# EAGLE design Shield (EAGLE 9.4.2)
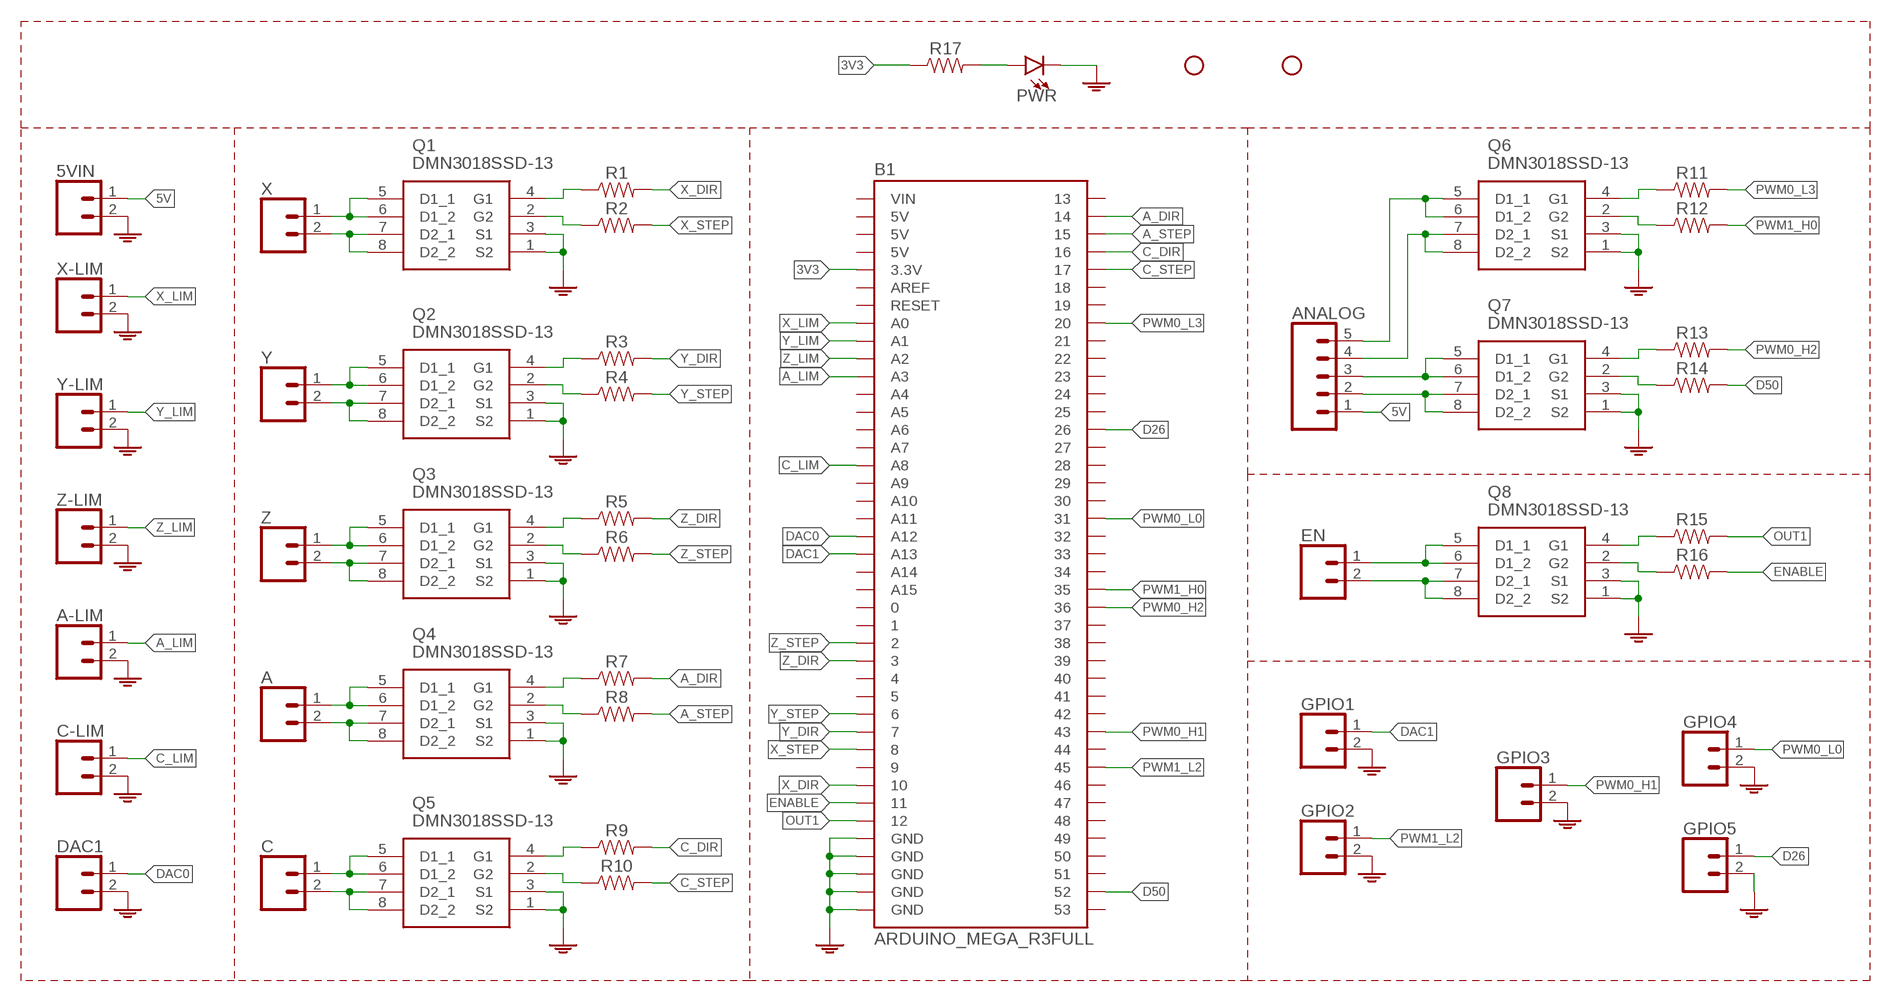
[diagram p0: schematic, sheet 1]

## Parts
5VIN  2P-SCREWTERMINAL-PLUGABLE  [SCREWTERMINAL-3.5MM-2_LOCK]
A  2P-SCREWTERMINAL-PLUGABLE  [SCREWTERMINAL-3.5MM-2_LOCK]
A-LIM  2P-SCREWTERMINAL-PLUGABLE  [SCREWTERMINAL-3.5MM-2_LOCK]
ANALOG  JST-XH-5P  [JST-XH-5P]
B1  ARDUINO_MEGA_R3FULL  [ARDUINO_MEGA]
C  2P-SCREWTERMINAL-PLUGABLE  [SCREWTERMINAL-3.5MM-2_LOCK]
C-LIM  2P-SCREWTERMINAL-PLUGABLE  [SCREWTERMINAL-3.5MM-2_LOCK]
DAC1  2P-SCREWTERMINAL-PLUGABLE  [SCREWTERMINAL-3.5MM-2_LOCK]
EN  2P-SCREWTERMINAL-PLUGABLE  [SCREWTERMINAL-3.5MM-2_LOCK]
GPIO1  2P-SCREWTERMINAL-PLUGABLE  [SCREWTERMINAL-3.5MM-2_LOCK]
GPIO2  2P-SCREWTERMINAL-PLUGABLE  [SCREWTERMINAL-3.5MM-2_LOCK]
GPIO3  2P-SCREWTERMINAL-PLUGABLE  [SCREWTERMINAL-3.5MM-2_LOCK]
GPIO4  2P-SCREWTERMINAL-PLUGABLE  [SCREWTERMINAL-3.5MM-2_LOCK]
GPIO5  2P-SCREWTERMINAL-PLUGABLE  [SCREWTERMINAL-3.5MM-2_LOCK]
H1  STAND-OFF  [STAND-OFF]
H2  STAND-OFF  [STAND-OFF]
PWR  LED-1206  [LED_1206]
Q1  DMN3018SSD-13  [SOIC127P600X175-8N]
Q2  DMN3018SSD-13  [SOIC127P600X175-8N]
Q3  DMN3018SSD-13  [SOIC127P600X175-8N]
Q4  DMN3018SSD-13  [SOIC127P600X175-8N]
Q5  DMN3018SSD-13  [SOIC127P600X175-8N]
Q6  DMN3018SSD-13  [SOIC127P600X175-8N]
Q7  DMN3018SSD-13  [SOIC127P600X175-8N]
Q8  DMN3018SSD-13  [SOIC127P600X175-8N]
R1  RESISTOR-SMD-1206  [RES_1206]
R2  RESISTOR-SMD-1206  [RES_1206]
R3  RESISTOR-SMD-1206  [RES_1206]
R4  RESISTOR-SMD-1206  [RES_1206]
R5  RESISTOR-SMD-1206  [RES_1206]
R6  RESISTOR-SMD-1206  [RES_1206]
R7  RESISTOR-SMD-1206  [RES_1206]
R8  RESISTOR-SMD-1206  [RES_1206]
R9  RESISTOR-SMD-1206  [RES_1206]
R10  RESISTOR-SMD-1206  [RES_1206]
R11  RESISTOR-SMD-1206  [RES_1206]
R12  RESISTOR-SMD-1206  [RES_1206]
R13  RESISTOR-SMD-1206  [RES_1206]
R14  RESISTOR-SMD-1206  [RES_1206]
R15  RESISTOR-SMD-1206  [RES_1206]
R16  RESISTOR-SMD-1206  [RES_1206]
R17  RESISTOR-SMD-1206  [RES_1206]
X  2P-SCREWTERMINAL-PLUGABLE  [SCREWTERMINAL-3.5MM-2_LOCK]
X-LIM  2P-SCREWTERMINAL-PLUGABLE  [SCREWTERMINAL-3.5MM-2_LOCK]
Y  2P-SCREWTERMINAL-PLUGABLE  [SCREWTERMINAL-3.5MM-2_LOCK]
Y-LIM  2P-SCREWTERMINAL-PLUGABLE  [SCREWTERMINAL-3.5MM-2_LOCK]
Z  2P-SCREWTERMINAL-PLUGABLE  [SCREWTERMINAL-3.5MM-2_LOCK]
Z-LIM  2P-SCREWTERMINAL-PLUGABLE  [SCREWTERMINAL-3.5MM-2_LOCK]

## Nets
3V3: B1.3.3V R17.1
5V: 5VIN.1 ANALOG.1
A_DIR: B1.14 R7.2
A_LIM: A-LIM.1 B1.A3
A_STEP: B1.15 R8.2
AGND: 5VIN.2 A-LIM.2 B1.GND@0(GND) B1.GND@1(GND) B1.GND@2(GND) B1.GND@3(GND) B1.GND@4(GND) C-LIM.2 DAC1.2 GPIO1.2 GPIO2.2 GPIO3.2 GPIO4.2 GPIO5.2 PWR.C Q1.1(S2) Q1.3(S1) Q2.1(S2) Q2.3(S1) Q3.1(S2) Q3.3(S1) Q4.1(S2) Q4.3(S1) Q5.1(S2) Q5.3(S1) Q6.1(S2) Q6.3(S1) Q7.1(S2) Q7.3(S1) Q8.1(S2) Q8.3(S1) X-LIM.2 Y-LIM.2 Z-LIM.2 ; supply symbol labelled GND
C_DIR: B1.16 R9.2
C_LIM: B1.A8 C-LIM.1
C_STEP: B1.17 R10.2
D26: B1.26 GPIO5.1
D50: B1.52 R14.2
DAC0: B1.A12 DAC1.1
DAC1: B1.A13 GPIO1.1
ENABLE: B1.11 R16.2
N$1: Q1.7(D2_1) Q1.8(D2_2) X.2
N$2: Q1.5(D1_1) Q1.6(D1_2) X.1
N$3: Q2.7(D2_1) Q2.8(D2_2) Y.2
N$4: EN.2 Q8.7(D2_1) Q8.8(D2_2)
N$5: Q1.2(G2) R2.1
N$6: Q1.4(G1) R1.1
N$7: EN.1 Q8.5(D1_1) Q8.6(D1_2)
N$8: Q2.5(D1_1) Q2.6(D1_2) Y.1
N$9: Q2.2(G2) R4.1
N$10: Q8.2(G2) R16.1
N$11: Q8.4(G1) R15.1
N$12: Q2.4(G1) R3.1
N$13: Q3.7(D2_1) Q3.8(D2_2) Z.2
N$14: Q3.5(D1_1) Q3.6(D1_2) Z.1
N$15: PWR.A R17.2
N$16: Q3.2(G2) R6.1
N$25: Q3.4(G1) R5.1
N$26: A.2 Q4.7(D2_1) Q4.8(D2_2)
N$27: A.1 Q4.5(D1_1) Q4.6(D1_2)
N$28: Q4.2(G2) R8.1
N$37: Q4.4(G1) R7.1
N$38: C.2 Q5.7(D2_1) Q5.8(D2_2)
N$39: C.1 Q5.5(D1_1) Q5.6(D1_2)
N$40: Q5.2(G2) R10.1
N$41: Q5.4(G1) R9.1
N$42: ANALOG.4 Q6.7(D2_1) Q6.8(D2_2)
N$43: ANALOG.5 Q6.5(D1_1) Q6.6(D1_2)
N$44: Q6.2(G2) R12.1
N$45: Q6.4(G1) R11.1
N$46: ANALOG.2 Q7.7(D2_1) Q7.8(D2_2)
N$47: ANALOG.3 Q7.5(D1_1) Q7.6(D1_2)
N$48: Q7.2(G2) R14.1
N$49: Q7.4(G1) R13.1
OUT1: B1.12 R15.2
PWM0_H1: B1.43 GPIO3.1
PWM0_H2: B1.36 R13.2
PWM0_L0: B1.31 GPIO4.1
PWM0_L3: B1.20 R11.2
PWM1_H0: B1.35 R12.2
PWM1_L2: B1.45 GPIO2.1
X_DIR: B1.10 R1.2
X_LIM: B1.A0 X-LIM.1
X_STEP: B1.8 R2.2
Y_DIR: B1.7 R3.2
Y_LIM: B1.A1 Y-LIM.1
Y_STEP: B1.6 R4.2
Z_DIR: B1.3 R5.2
Z_LIM: B1.A2 Z-LIM.1
Z_STEP: B1.2 R6.2
Unconnected: B1.0 B1.1 B1.4 B1.5 B1.5V@0(5V) B1.5V@1(5V) B1.5V@2(5V) B1.9 B1.13 B1.18 B1.19 B1.21 B1.22 B1.23 B1.24 B1.25 B1.27 B1.28 B1.29 B1.30 B1.32 B1.33 B1.34 B1.37 B1.38 B1.39 B1.40 B1.41 B1.42 B1.44 B1.46 B1.47 B1.48 B1.49 B1.50 B1.51 B1.53 B1.A4 B1.A5 B1.A6 B1.A7 B1.A9 B1.A10 B1.A11 B1.A14 B1.A15 B1.AREF B1.RESET B1.VIN

## Library data of the parts
5VIN A A-LIM C C-LIM DAC1 EN GPIO1-GPIO5 X X-LIM Y Y-LIM Z Z-LIM = Shield:2P-SCREWTERMINAL-PLUGABLE: 2P Screw Terminal ; 3.5mm pitch; Plugable Dont forget the cleareance nedded for the plug
ANALOG = Shield:JST-XH-5P
B1 = Shield:ARDUINO_MEGA_R3: Arduino Mega R3 ATmega2560 R3 compatible footprint. SparkFun Products: Arduino Mega 2560 R3 <https://www.sparkfun.com/products/11061>
H1 H2 = SparkFun-Hardware:STAND-OFF: Stand Off Drill holes for mechanically mounting via screws, standoffs, etc. Note: Use the keepout ring to avoid running the screw head into surrounding components. Variant Overviews STAND-OFF - Mechanical footprint for a #4 phillips button head screw. STAND-OFF-TIGHT - Mechanical footprint for a #4 phillips button head screw, Example SparkFun Products Screw - Phillips Head (1/4", 4-40, 10 pack) <https://www.sparkfun.com/products/10453> (PRT-10453) Screw - Phillips Head (1/2", 4-40, 10 pack) <https://www.sparkfun.com/products/10452> (PRT-10452) Screw - Phillips Head (3/4", 4-40, 10 pack) <https://www.sparkfun.com/products/10451> (PRT-10451) Screw - Phillips Head (1", 4-40, 10 pack) <https://www.sparkfun.com/products/10450> (PRT-10450)
PWR = Shield:LED-1206
Q1-Q8 = Shield:DMN3018SSD-13: Diodes Inc DMN3018SSD-13 N-channel MOSFET Transistor, 8.7 A, 30 V, 8-Pin SOIC Source: Datasheet <https://componentsearchengine.com/Datasheets/1/DMN3018SSD-13.pdf>; DESCRIPTION: Diodes Inc DMN3018SSD-13 N-channel MOSFET Transistor, 8.7 A, 30 V, 8-Pin SOIC; HEIGHT: 1.75mm; MANUFACTURER_NAME: Diodes Inc.; MANUFACTURER_PART_NUMBER: DMN3018SSD-13; MOUSER_PART_NUMBER: 621-DMN3018SSD-13; MOUSER_PRICE-STOCK: https://www.mouser.com/Search/Refine.aspx?Keyword=621-DMN3018SSD-13
R1-R17 = Shield:RESISTOR-SMD-1206

## Board
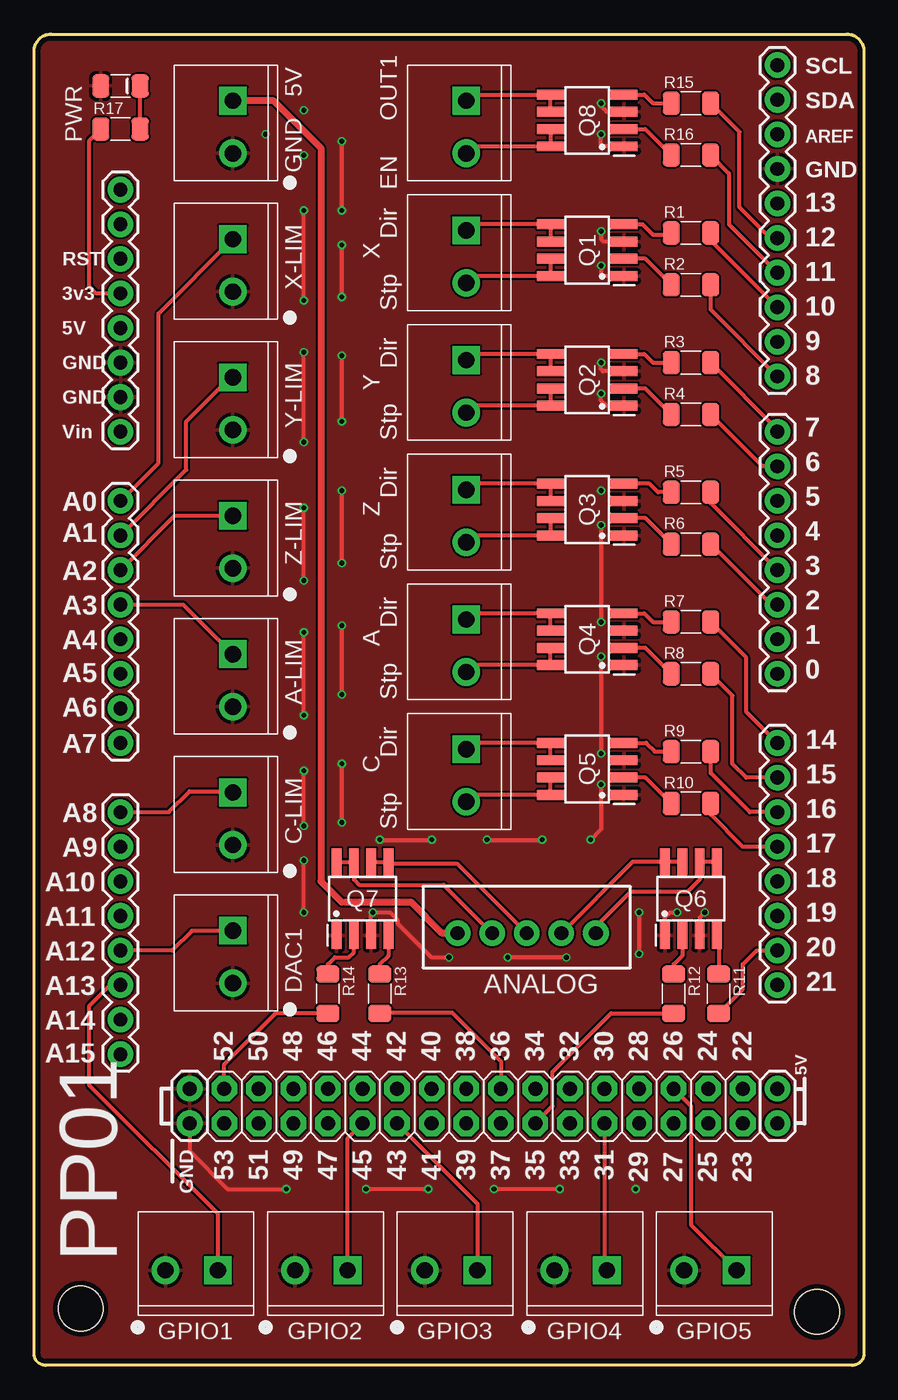
[diagram p1: board, top side]
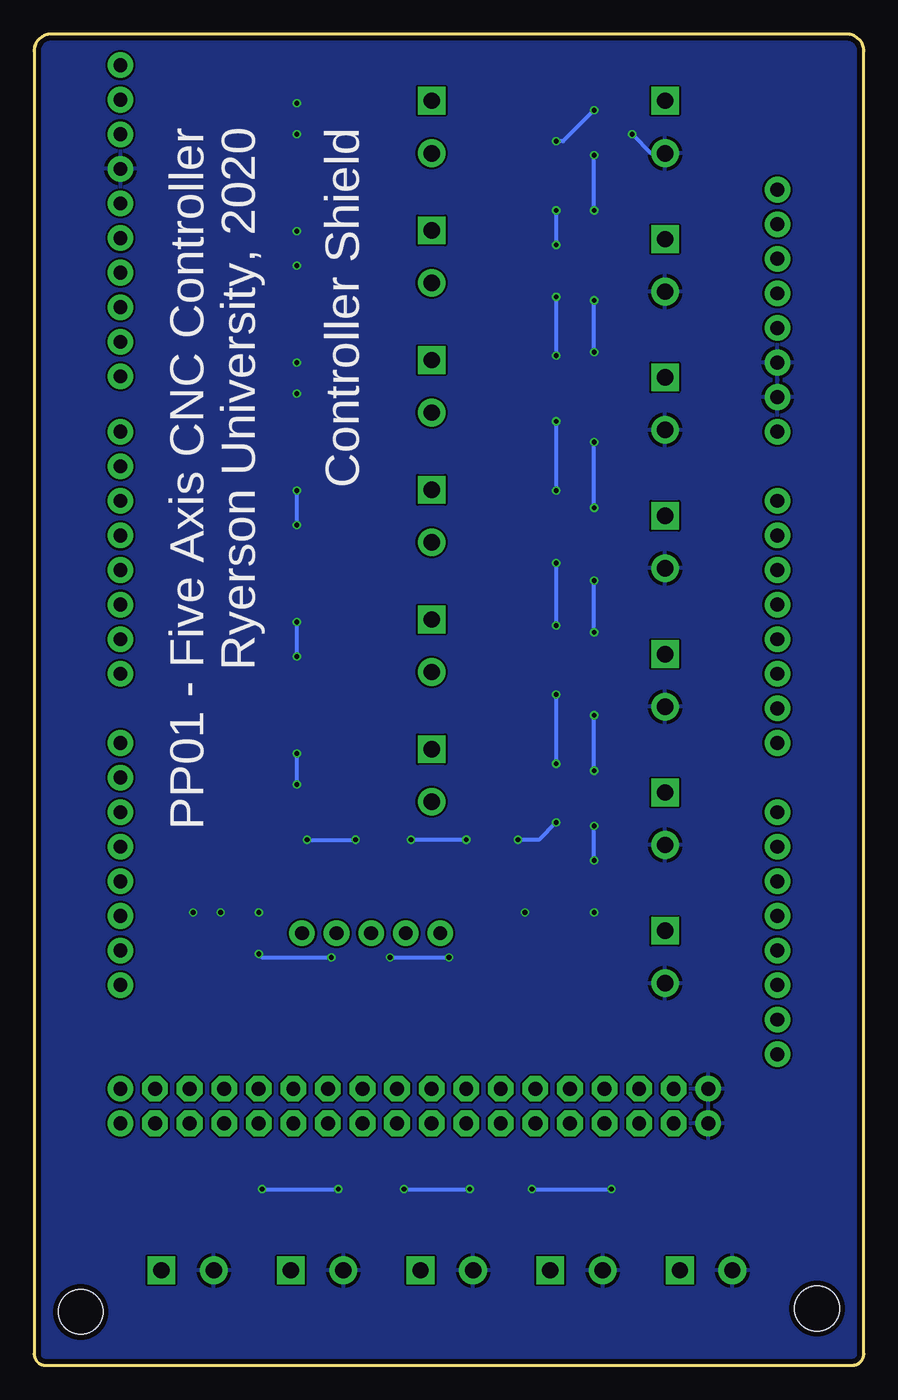
[diagram p2: board, bottom side, seen from below]

Size 60.96 x 97.79 mm. Coordinates in mm from the lower left corner, seen from the top.
Outline: 1.27,97.79 59.69,97.79 arc-90 60.96,96.52 60.96,0.87 arc-90 60.09,0 0.87,0 arc-90 0,0.87 0,96.52 arc-90 1.27,97.79
Copper layers (1*16): Top 0.035559375mm / dielectric 1.6mm / Bottom 0.035559375mm
Design rules "oshpark-2layer-tented *": minimum track width 12mil, minimum drill 10mil, track to track 6mil, track to pad 6mil, pad to pad 6mil, via to via 6mil, smd to smd 6mil, copper to edge 15mil, drill to drill 6mil, minimum pad ring 5mil, minimum via ring 5mil, stop-mask expansion 2.5mil, vias tented up to drill 20mil, thermal gap 10mil

### Footprints (pad centres in the part's own frame; a part is rotated, then mirrored left to right if it is on the bottom)
SCREWTERMINAL-3.5MM-2_LOCK = drill 1.2 pad 2.032 square: 1 -0.178,0 | drill 1.2 pad 2.032: 2 3.678,0
JST-XH-5P = drill 1.016 pad 1.88: 1 0,0; 2 2.54,0; 3 5.08,0; 4 7.62,0; 5 10.16,0
ARDUINO_MEGA = drill 1.016 pad 1.88: 0 13.97,24.13; 1 11.43,24.13; 2 8.89,24.13; 3 6.35,24.13; 3.3V -13.97,-24.13; 4 3.81,24.13; 5 1.27,24.13; 5V@0 -11.43,-24.13; 5V@1 44.45,24.13; 5V@2 46.99,24.13; 6 -1.27,24.13; 7 -3.81,24.13; 8 -7.874,24.13; 9 -10.414,24.13; 10 -12.954,24.13; 11 -15.494,24.13; 12 -18.034,24.13; 13 -20.574,24.13; 14 19.05,24.13; 15 21.59,24.13; 16 24.13,24.13; 17 26.67,24.13; 18 29.21,24.13; 19 31.75,24.13; 20 34.29,24.13; 21 36.83,24.13; A0 1.27,-24.13; A1 3.81,-24.13; A2 6.35,-24.13; A3 8.89,-24.13; A4 11.43,-24.13; A5 13.97,-24.13; A6 16.51,-24.13; A7 19.05,-24.13; A8 24.13,-24.13; A9 26.67,-24.13; A10 29.21,-24.13; A11 31.75,-24.13; A12 34.29,-24.13; A13 36.83,-24.13; A14 39.37,-24.13; A15 41.91,-24.13; AREF -25.654,24.13; GND@0 -8.89,-24.13; GND@1 -6.35,-24.13; GND@2 44.45,-19.05; GND@3 46.99,-19.05; GND@4 -23.114,24.13; IOREF -19.05,-24.13; RESET -16.51,-24.13; SCL -30.734,24.13; SDA -28.194,24.13; VBAT -21.59,-24.13; VIN -3.81,-24.13 | drill 1.016 pad 1.88 octagon: 22 44.45,21.59; 23 46.99,21.59; 24 44.45,19.05; 25 46.99,19.05; 26 44.45,16.51; 27 46.99,16.51; 28 44.45,13.97; 29 46.99,13.97; 30 44.45,11.43; 31 46.99,11.43; 32 44.45,8.89; 33 46.99,8.89; 34 44.45,6.35; 35 46.99,6.35; 36 44.45,3.81; 37 46.99,3.81; 38 44.45,1.27; 39 46.99,1.27; 40 44.45,-1.27; 41 46.99,-1.27; 42 44.45,-3.81; 43 46.99,-3.81; 44 44.45,-6.35; 45 46.99,-6.35; 46 44.45,-8.89; 47 46.99,-8.89; 48 44.45,-11.43; 49 46.99,-11.43; 50 44.45,-13.97; 51 46.99,-13.97; 52 44.45,-16.51; 53 46.99,-16.51
STAND-OFF = hole 3.302: 0,0
LED_1206 = smd 1.24 x 1.68: A -1.445,0; C 1.445,0
SOIC127P600X175-8N = smd 1.981 x 0.726: 1 -2.7,1.905; 2 -2.7,0.635; 3 -2.7,-0.635; 4 -2.7,-1.905; 5 2.7,-1.905; 6 2.7,-0.635; 7 2.7,0.635; 8 2.7,1.905
RES_1206 = smd 1.24 x 1.68: 1 -1.445,0; 2 1.445,0

### Placement (x,y rotation side)
5VIN  14.61,92.71 270 top
A  31.75,54.61 270 top
A-LIM  14.61,52.07 270 top
ANALOG  31.11,31.75 0 top
B1  30.48,64.77 270 top
C  31.75,45.09 270 top
C-LIM  14.61,41.91 270 top
DAC1  14.61,31.75 270 top
EN  31.75,92.71 270 top
GPIO1  13.34,6.99 180 top
GPIO2  22.86,6.99 180 top
GPIO3  32.38,6.99 180 top
GPIO4  41.91,6.99 180 top
GPIO5  51.44,6.99 180 top
H1  3.43,4.19 0 top
H2  57.53,3.94 0 top
PWR  6.35,93.98 180 top
Q1  40.64,81.92 180 top
Q2  40.64,72.39 180 top
Q3  40.64,62.87 180 top
Q4  40.64,53.34 180 top
Q5  40.64,43.81 180 top
Q6  48.26,34.29 90 top
Q7  24.13,34.29 90 top
Q8  40.64,91.44 180 top
R1  48.26,83.19 0 top
R2  48.26,79.38 0 top
R3  48.26,73.66 0 top
R4  48.26,69.85 0 top
R5  48.26,64.14 0 top
R6  48.26,60.33 0 top
R7  48.26,54.61 0 top
R8  48.26,50.8 0 top
R9  48.26,45.09 0 top
R10  48.26,41.27 0 top
R11  50.29,27.3 270 top
R12  46.99,27.3 270 top
R13  25.4,27.3 270 top
R14  21.59,27.3 270 top
R15  48.26,92.71 0 top
R16  48.26,88.9 0 top
R17  6.35,90.81 0 top
X  31.75,83.19 270 top
X-LIM  14.61,82.55 270 top
Y  31.75,73.66 270 top
Y-LIM  14.61,72.39 270 top
Z  31.75,64.14 270 top
Z-LIM  14.61,62.23 270 top

### Tracks (layer width: path | path; a pad name or v marks a point on that pad's centre or on a via)
3V3
  Top 0.305: B1.3.3V 4.57,78.74 4.06,79.25 4.06,89.96 R17.1
5V
  Top 0.305: 22.61,34.04 22.86,34.04
  Top 0.508: ANALOG.1 29.97,31.75 27.69,34.04 22.86,34.04 | 5VIN.1 17.6,92.89 21.08,89.41 21.08,35.56 22.61,34.04
A_DIR
  Top 0.305: B1.14 52.32,48.01 52.32,51.99 R7.2
A_LIM
  Top 0.305: B1.A3 10.97,55.88 A-LIM.1
A_STEP
  Top 0.305: B1.15 52.32,43.18 51.31,44.2 51.31,49.2 R8.2
AGND  (via drill 0.35)
  Top 0.305: Q8.3 42.07,92.08 41.66,92.49 v41.66,92.71 | Q8.1 41.78,89.53 41.66,89.66 v41.66,90.42 | Q1.3 41.82,82.55 41.66,82.71 v41.66,83.31 | Q1.1 41.66,80.01 v41.66,80.77 | Q2.3 41.78,73.03 41.66,73.15 v41.66,73.66 | Q2.1 42.04,70.48 41.66,70.87 v41.66,71.37 | v49.28,33.27 48.9,32.89 Q6.3 | Q6.1 46.35,32.89 46.74,33.27 v47.24,33.27 | Q7.3 24.77,33.15 v24.89,33.27 26.14,33.27 26.7,32.71 26.7,32.48 29.21,29.97 v30.48,29.97 | Q7.1 22.13,31.5 | v19.81,47.75 v19.81,53.85 | v19.81,57.66 v19.81,62.99 | v19.81,67.82 v19.81,74.42 | v19.81,78.23 v19.81,84.84 | v19.81,33.27 v19.81,37.08 | v19.81,39.62 v19.81,43.69 | v22.61,89.92 v22.61,84.84 | v22.61,82.3 v22.61,78.49 | v22.61,74.17 v22.61,69.34 | v22.61,64.26 v22.61,58.93 | v22.61,54.36 v22.61,49.28 | v22.61,44.2 v22.61,39.88 | v25.4,38.61 v29.21,38.61 | v33.27,38.61 v37.34,38.61 | v40.89,38.61 41.66,39.37 v41.66,42.67 | v41.66,52.07 v41.66,44.96 | v41.66,61.72 v41.66,54.61 | v39.12,29.97 v34.8,29.97 | v44.45,33.27 v44.45,30.23 | B1.GND@3 11.43,15.75 14.22,12.95 v18.54,12.95 | v28.96,12.95 v24.38,12.95 | v38.61,12.95 v33.78,12.95
  Bottom 0.305: v19.81,37.08 v19.81,39.62 | v19.81,43.69 v19.81,47.75 | v19.81,53.85 v19.81,57.66 | v19.81,62.99 v19.81,67.82 | v19.81,74.42 v19.81,78.23 | v19.81,84.84 v19.81,88.9 | 5VIN.2 15.63,89.03 v17.02,90.42 | v19.81,92.2 22.1,89.92 v22.61,89.92 | v22.61,84.84 v22.61,82.3 | v22.61,78.49 v22.61,74.17 | v22.61,69.34 v22.61,64.26 | v22.61,58.93 v22.61,54.36 | v22.61,49.28 v22.61,44.2 | v22.61,39.88 23.88,38.61 v25.4,38.61 | v29.21,38.61 v33.27,38.61 | v40.89,38.61 v37.34,38.61 | v41.66,44.96 v41.66,42.67 | v41.66,54.61 v41.66,52.07 | v41.66,64.26 v41.66,61.72 | v34.8,29.97 v30.48,29.97 | v44.45,30.23 44.2,29.97 v39.12,29.97 | v24.38,12.95 v18.54,12.95 | v33.78,12.95 v28.96,12.95 | v44.2,12.95 v38.61,12.95
  pour Top: 60.33,0.13 0.56,0.13 arc-90 0.13,0.56 0.13,96.72 arc-90 1.2,97.79 59.69,97.79 arc-90 60.96,96.52 60.96,0.76 arc-90
  pour Bottom: 0,96.52 0,0.87 arc90 0.87,0 60.09,0 arc90 60.96,0.87 60.96,96.52 arc90 59.69,97.79 1.27,97.79 arc90
C_DIR
  Top 0.305: B1.16 52.57,40.64 49.7,43.51 R9.2
C_LIM
  Top 0.305: B1.A8 9.91,40.64 11.43,42.16 14.53,42.16 C-LIM.1
C_STEP
  Top 0.305: B1.17 52.07,38.1 49.7,40.47 R10.2
D26
  Top 0.305: B1.26 48.26,19.05 48.26,10.34 GPIO5.1
D50
  Top 0.305: R14.2 21.54,25.91 17.78,25.91 13.97,22.1 B1.52
DAC0
  Top 0.305: DAC1.1 11.61,31.93 10.16,30.48 B1.A12
DAC1
  Top 0.305: GPIO1.1 13.51,11.12 4.06,20.57 4.06,26.42 5.59,27.94 B1.A13
ENABLE
  Top 0.305: R16.2 51.05,87.55 51.05,83.82 B1.11
N$1
  Top 0.305: Q1.7 Q1.8 32.25,80.01 X.2
N$2
  Top 0.305: Q1.6 Q1.5 32.51,83.82 32.26,84.07 31.75,83.57 X.1
N$3
  Top 0.305: Q2.7 Q2.8 32.25,70.48 Y.2
N$4
  Top 0.305: EN.2 32.25,89.53 Q8.8 Q8.7
N$5
  Top 0.305: R2.1 44.91,81.28 Q1.2
N$6
  Top 0.305: Q1.4 44.7,83.82 45.47,83.06 46.69,83.06 R1.1
N$7
  Top 0.305: Q8.6 Q8.5 32.21,93.34 EN.1
N$8
  Top 0.305: Q2.6 Q2.5 32.21,74.3 Y.1
N$9
  Top 0.305: R4.1 44.91,71.75 Q2.2
N$10
  Top 0.305: Q8.2 44.91,90.81 R16.1
N$11
  Top 0.305: Q8.4 44.83,93.34 45.47,92.71 R15.1
N$12
  Top 0.305: Q2.4 44.83,74.3 45.47,73.66 R3.1
N$13
  Top 0.305: Q3.7 Q3.8 32.25,60.96 Z.2
N$14
  Top 0.305: Q3.6 Q3.5 32.21,64.77 Z.1
N$15
  Top 0.305: R17.2 PWR.A
N$16
  Top 0.305: R6.1 44.91,62.23 Q3.2
N$25
  Top 0.305: R5.1 45.85,64.14 45.21,64.77 Q3.4
N$26
  Top 0.305: Q4.7 Q4.8 32.25,51.44 A.2
N$27
  Top 0.305: Q4.6 Q4.5 32.21,55.24 A.1
N$28
  Top 0.305: R8.1 44.91,52.7 Q4.2
N$37
  Top 0.305: Q4.4 44.83,55.24 45.47,54.61 R7.1
N$38
  Top 0.305: Q5.7 Q5.8 32.25,41.91 C.2
N$39
  Top 0.305: Q5.6 Q5.5 32.21,45.72 C.1
N$40
  Top 0.305: R10.1 44.91,43.18 Q5.2
N$41
  Top 0.305: Q5.4 44.96,45.72 45.59,45.09 R9.1
N$42
  Top 0.305: ANALOG.4 43.98,36.99 Q6.8 Q6.7
N$43
  Top 0.305: ANALOG.5 41.27,32.26 43.81,34.8 48.01,34.8 48.9,35.69 Q6.6 Q6.5
N$44
  Top 0.305: Q6.2 47.62,30.1 46.99,29.46 R12.1
N$45
  Top 0.305: Q6.4 50.26,31.5 50.29,31.5 R11.1
N$46
  Top 0.305: Q7.8 Q7.7 23.5,35.69 23.88,35.31 30.1,35.31 ANALOG.2
N$47
  Top 0.305: Q7.6 Q7.5 26.2,36.83 31.11,36.83 ANALOG.3
N$48
  Top 0.305: Q7.2 23.5,30.35 23.11,29.97 22.1,29.97 21.59,29.46 R14.1
N$49
  Top 0.305: Q7.4 26.04,30.1 25.4,29.46 R13.1
OUT1
  Top 0.305: B1.12 54.1,82.8 51.82,85.09 51.82,90.6 R15.2
PWM0_H1
  Top 0.305: B1.43 32.56,11.89 GPIO3.1
PWM0_H2
  Top 0.305: R13.2 25.45,25.91 30.73,25.91 34.29,22.35 B1.36
PWM0_L0
  Top 0.305: B1.31 41.91,7.16 GPIO4.1
PWM0_L3
  Top 0.305: R11.2 52.07,27.64 52.07,29.46 53.09,30.48 B1.20
PWM1_H0
  Top 0.305: B1.35 38.1,19.05 38.1,21.57 42.39,25.86 R12.2
PWM1_L2
  Top 0.305: GPIO2.1 23.04,16.69 B1.45
X_DIR
  Top 0.305: B1.10 49.7,82.63 R1.2
X_LIM
  Top 0.305: B1.A0 9.14,66.29 9.14,77.27 X-LIM.1
X_STEP
  Top 0.305: R2.2 49.7,77.55 B1.8
Y_DIR
  Top 0.305: R3.2 54.61,68.75 B1.7
Y_LIM
  Top 0.305: B1.A1 11.18,65.79 11.18,69.34 14.4,72.57 Y-LIM.1
Y_STEP
  Top 0.305: B1.6 53.52,66.04 R4.2
Z_DIR
  Top 0.305: B1.3 49.7,63.33 R5.2
Z_LIM
  Top 0.305: B1.A2 10.34,62.41 Z-LIM.1
Z_STEP
  Top 0.305: R6.2 54.15,55.88 B1.2

### Text on the board
tPlace: OUT1 | GND 5V | Stp Dir | Stp Dir | Stp Dir | Stp Dir | Stp Dir | PP01
bPlace: PP01 - Five Axis CNC Controller / Ryerson University, 2020 / / Controller Shield